# Altium schematic sheet isolator.SchDoc
size A4; Author: Mikołaj Pichita; CompanyName: AGH University of Science and Technology; SheetNumber: 10; SheetTotal: 16
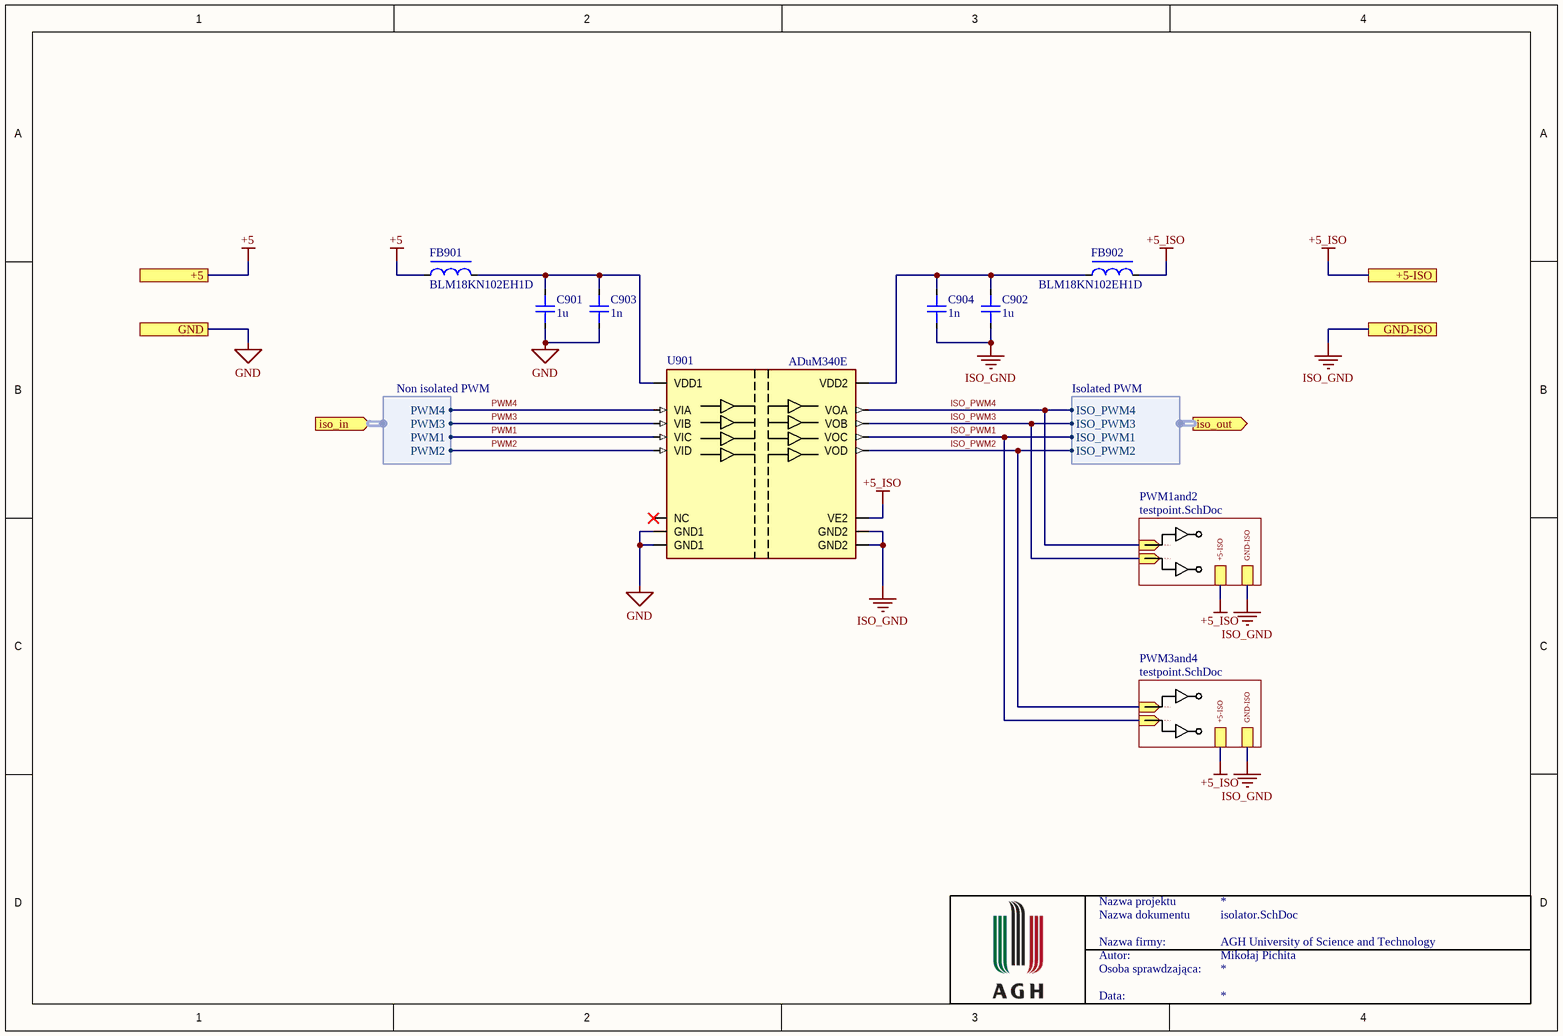
[diagram p0: isolator.SchDoc]

## Parts
C901  1u  [CAP0603]
C902  1u  [CAP0603]
C903  1n  [CAP0603]
C904  1n  [CAP0603]
FB901  BLM18KN102EH1D  [RES0603]
FB902  BLM18KN102EH1D  [RES0603]
U901  ADuM340E  [SOIC127P1030X265-16N]

## Sub-sheets
PWM1and2 = testpoint.SchDoc: TP_IN_1 (in), TP_IN_2 (in), +5-ISO, GND-ISO
PWM3and4 = testpoint.SchDoc: TP_IN_1 (in), TP_IN_2 (in), +5-ISO, GND-ISO

## Ports
+5 (see main[3B], choke_current_meas[4B], current_sense_shunt[4A], full_bridge[1C], measurements[1C], microcontroller[1C], power_supply[2B], voltage_sense[4A]), +5-ISO (see main[3B], full_bridge[1B], measurements[1B], OV_OC[1B], power_supply[3B], testpoint[2A]), GND (see main[3B], choke_current_meas[4B], current_sense_shunt[4B], full_bridge[1D], measurements[1C], microcontroller[1C], power_supply[1B], voltage_sense[4B]), GND-ISO (see main[3B], full_bridge[1B], input_filter[2C], measurements[1B], output_filter[1B], OV_OC[1B], power_supply[3B], testpoint[2A], voltage_sense[1B]), iso_in (in, harness Non isolated PWM, see main[3B]), iso_out (out, harness Isolated PWM, see main[3B])

## Harnesses
Isolated PWM: ISO_PWM4, ISO_PWM1, ISO_PWM2, ISO_PWM3
Non isolated PWM: PWM1, PWM2, PWM3, PWM4

## Nets
+5: FB901.2 ; port +5
+5_ISO: FB902.1 U901.10(VE2) ; port +5-ISO, sheet PWM1and2/+5-ISO, sheet PWM3and4/+5-ISO
GND: C901.1 C903.2 U901.2(GND1) U901.8(GND1) ; port GND
ISO_GND: C902.1 C904.2 U901.9(GND2) U901.15(GND2) ; port GND-ISO, sheet PWM1and2/GND-ISO, sheet PWM3and4/GND-ISO
ISO_PWM1: U901.12(VOC) ; sheet PWM3and4/TP_IN_2, port iso_out.ISO_PWM1
ISO_PWM2: U901.11(VOD) ; sheet PWM3and4/TP_IN_1, port iso_out.ISO_PWM2
ISO_PWM3: U901.13(VOB) ; sheet PWM1and2/TP_IN_2, port iso_out.ISO_PWM3
ISO_PWM4: U901.14(VOA) ; sheet PWM1and2/TP_IN_1, port iso_out.ISO_PWM4
PWM1: U901.5(VIC) ; port iso_in.PWM1
PWM2: U901.6(VID) ; port iso_in.PWM2
PWM3: U901.4(VIB) ; port iso_in.PWM3
PWM4: U901.3(VIA) ; port iso_in.PWM4
NetC901_2: C901.2 C903.1 FB901.1 U901.1(VDD1)
NetC902_2: C902.2 C904.1 FB902.2 U901.16(VDD2)

Not connected (* = marked no-connect by the designer): U901 7(NC)*

## Notes on the sheet
- Nazwa projektu
- Nazwa dokumentu
- Nazwa firmy:
- Autor:
- Osoba sprawdzająca:
- Data:

## Library data of the parts
C901-C904 = Capacitor: Value: *; HelpURL: *; MPN: *; Supplier: *; SupplierPartNumber: *; Supplier 1: Mouser
  C901 C902: Supplier Part Number 1: 77-VJ0603Y333KXJAC
  C903 C904: Supplier Part Number 1: 581-0603YC102J4T2A
FB901 FB902 = Ferrite Bead: Value: *; HelpURL: *; MPN: *; Supplier: *; SupplierPartNumber: *; Supplier 1: Mouser; Supplier Part Number 1: 81-BLM18KN102EH1D
U901 = ADuM340E: 5.7 kV rms Quad Digital Isolators; Value: *; HelpURL: *; MPN: *; Supplier: *; SupplierPartNumber: *